# Altium schematic sheet DCDC-LMR16030.SchDoc
size A3; Engineer: Ehsan Shaghaei; Revision: 9; SheetNumber: 3; SheetTotal: 7
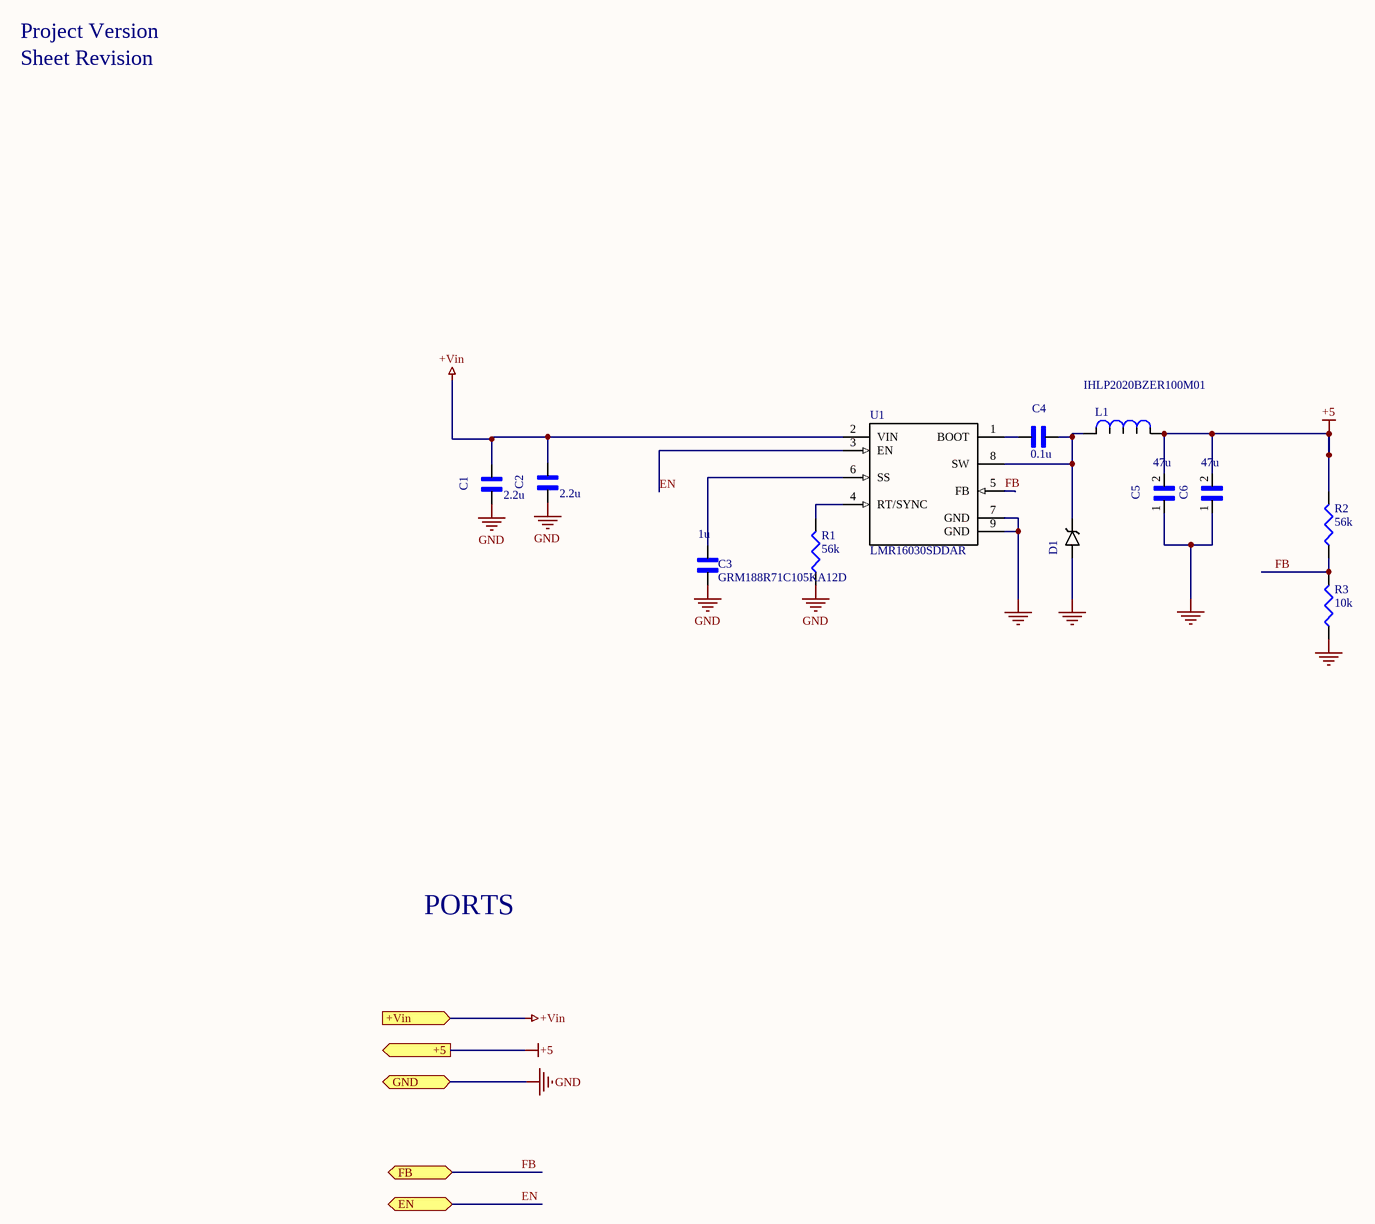
[diagram p0: DCDC-LMR16030.SchDoc]

## Parts
C1  value 2.2u  [*CAP3216X125N]  (hidden comment: GRM31CR71H225KA88L)
C2  value 2.2u  [*CAP3216X125N]  (hidden comment: GRM31CR71H225KA88L)
C3  GRM188R71C105KA12D  value 1u  [CAPC1608X90N]
C4  value 0.1u  [*CAPC1608X90]  (hidden comment: GX035C104MAT2-500)
C5  value 47u  [*CAPC3216X125N]  (hidden comment: GRM31CR61A476KE15L)
C6  value 47u  [*CAPC3216X125N]  (hidden comment: GRM31CR61A476KE15L)
D1  SK56  [*SMB_P6SMB62AT3G(Primary)]  (value not drawn)
L1  IHLP2020BZER100M01  [IHLP]
R1  value 56k  [J1-0603]  (hidden comment: Res3)
R2  value 56k  [J1-0603]  (hidden comment: Res3)
R3  value 10k  [J1-0603]  (hidden comment: RC0603FR-0710KL)
U1  LMR16030SDDAR  [*SOIC127P600X170-9N - duplicate]

## Ports
+5 (out), +Vin (in), EN (bidir), FB (bidir), GND (bidir)

## Nets
+5: C5.2 C6.2 L1.1 R2.2 ; port +5
+Vin: C1.1 C2.1 U1.2(VIN) ; port +Vin
GND: C1.2 C2.2 C3.1 C5.1 C6.1 D1.A R1.1 R3.1 U1.7(GND) U1.9(GND) ; port GND
EN: U1.3(EN) ; port EN
FB: R2.1 R3.2 U1.5(FB) ; port FB
NetC3_2: C3.2 U1.6(SS)
NetC4_1: C4.1 D1.C L1.2 U1.8(SW)
NetC4_2: C4.2 U1.1(BOOT)
NetR1_2: R1.2 U1.4(RT/SYNC)

## Notes on the sheet
- Project Version
- Sheet Revision
- PORTS

## Library data of the parts
C1 C2 = GRM31CR71H225KA88L: 1206 2.2 uF 50 V В±10% Tolerance X7R SMT Multilayer Ceramic Capacitor; MF: Murata Electronics; Type: SMD; Package: 1206 Murata; SnapEDA_Link: https://www.snapeda.com/parts/GRM31CR71H225KA88L/Murata%20Electronics%20North%20America/view-part/?ref=snap; MP: GRM31CR71H225KA88L
C3 = GRM188R71C105KA12D: SMD Capacitor X7R(EIA) with Capacitance: 1.0uF Tol. 10%. Rated Voltage: 16Vdc; MF: Murata Electronics; Pacage Metric: 1608; MP: GRM188R71C105KA12D; SnapEDA_Link: https://www.snapeda.com/parts/GRM188R71C105KA12D/Murata%20Electronics%20North%20America/view-part/228340/?ref=snap; Package: 0603; ChipDip_Link: https://www.chipdip.ru/product/grm188r71c105ka12d; HelpURL: https://static.chipdip.ru/lib/428/DOC005428493.pdf; Type: SMD
C4 = GX035C104MAT2-500: Cap Thin Film 0.1uf 50v 0603; MF: AVX; MP: GX035C104MAT2-500 or CL10B104JB8NNNC; Pacage Metric: 1608; Type: SMD; Package: 0603 AVX; SnapEDA_Link: https://www.snapeda.com/parts/GX035C104MAT2-500/AVX/view-part/?ref=snap
C5 C6 = GRM31CR61A476KE15L: Multilayer Ceramic Capacitor, GRM Series, 47 - F, - 10%, X5R, 10 V, 1206 [3216 Metric]; MF: Murata Electronics; Type: SMD; Package: 1206 Murata Electronics; MP: GRM31CR61A476KE15L; SnapEDA_Link: https://www.snapeda.com/parts/GRM31CR61A476KE15L/Murata%20Electronics%20North%20America/view-part/?ref=snap
D1 = SK56: Диод Шоттки 5А 60В [SMB / DO-214AA]; MF: Littelfuse Inc.; Type: SMD; MP: SK56; Package: DO-214 Littelfuse; SnapEDA_Link: https://www.snapeda.com/parts/P6SMB62AT3G/Littelfuse%20Inc./view-part/?ref=snap; Value: *; ChipDip_Link: https://www.chipdip.ru/product/sk56
L1 = IHLP2020BZER100M01: 10ÂµH Shielded Molded Inductor 2.3A 199mOhm Max Nonstandard; MF: Vishay Dale; Type: SMD; SnapEDA_Link: https://www.snapeda.com/parts/IHLP2020BZER100M01/Vishay%20Dale/view-part/44808/?ref=snap; MP: IHLP2020BZER100M01; Value: *; Package: Nonstandard Vishay; HelpURL: http://www.vishay.com/docs/34253/ihlp-2020bz-01.pdf; ChipDip_Link: https://www.chipdip.ru/product/ihlp2020bzer100m11-inductor-ihlp-smd-2020-10
R1 R2 = Res3: Resistor; Pacage Metric: 1608; MP: RC0603FR-0756KL; ChipDip_Link: https://www.chipdip.ru/product0/9000079754; HelpURL: https://www.chipdip.ru/product0/9000079754; Package: R0603; Type: SMD
R3 = RC0603FR-0710KL: 10 kOhms 1 0.1 W 1 10 W Chip Resistor 0603 1608 Metric Thick Film; Pacage Metric: 1608; MF: Yageo or NXP; MP: 10K 1% 0603; ChipDip_Link: https://www.chipdip.ru/product0/9000079736; HelpURL: https://www.chipdip.ru/product0/9000079736; Package: R0603; Type: SMD; SnapEDA_Link: https://www.snapeda.com/parts/RC0603FR-0710KL/Yageo/view-part/?ref=dk&t=RC0603FR-0710KL&con_ref=None
U1 = LMR16030SDDAR: LMR16030SDDAR, Conv DC-DC 4.3V to 60V Step Down Single-Out 1V to 50V 3A Automotive 8-Pin HSOP EP T/R; MF: Texas Instruments; SnapEDA_Link: https://www.snapeda.com/parts/TPS54560DDA/Texas%20Instruments/view-part/?ref=snap; MP: LMR16030SDDAR; Package: PowerSOIC-8 Texas Instruments; Value: *; Type: SMD; ChipDip_Link: https://www.chipdip.ru/product1/8003448566; HelpURL: https://www.ti.com/lit/ds/symlink/lmr16030.pdf